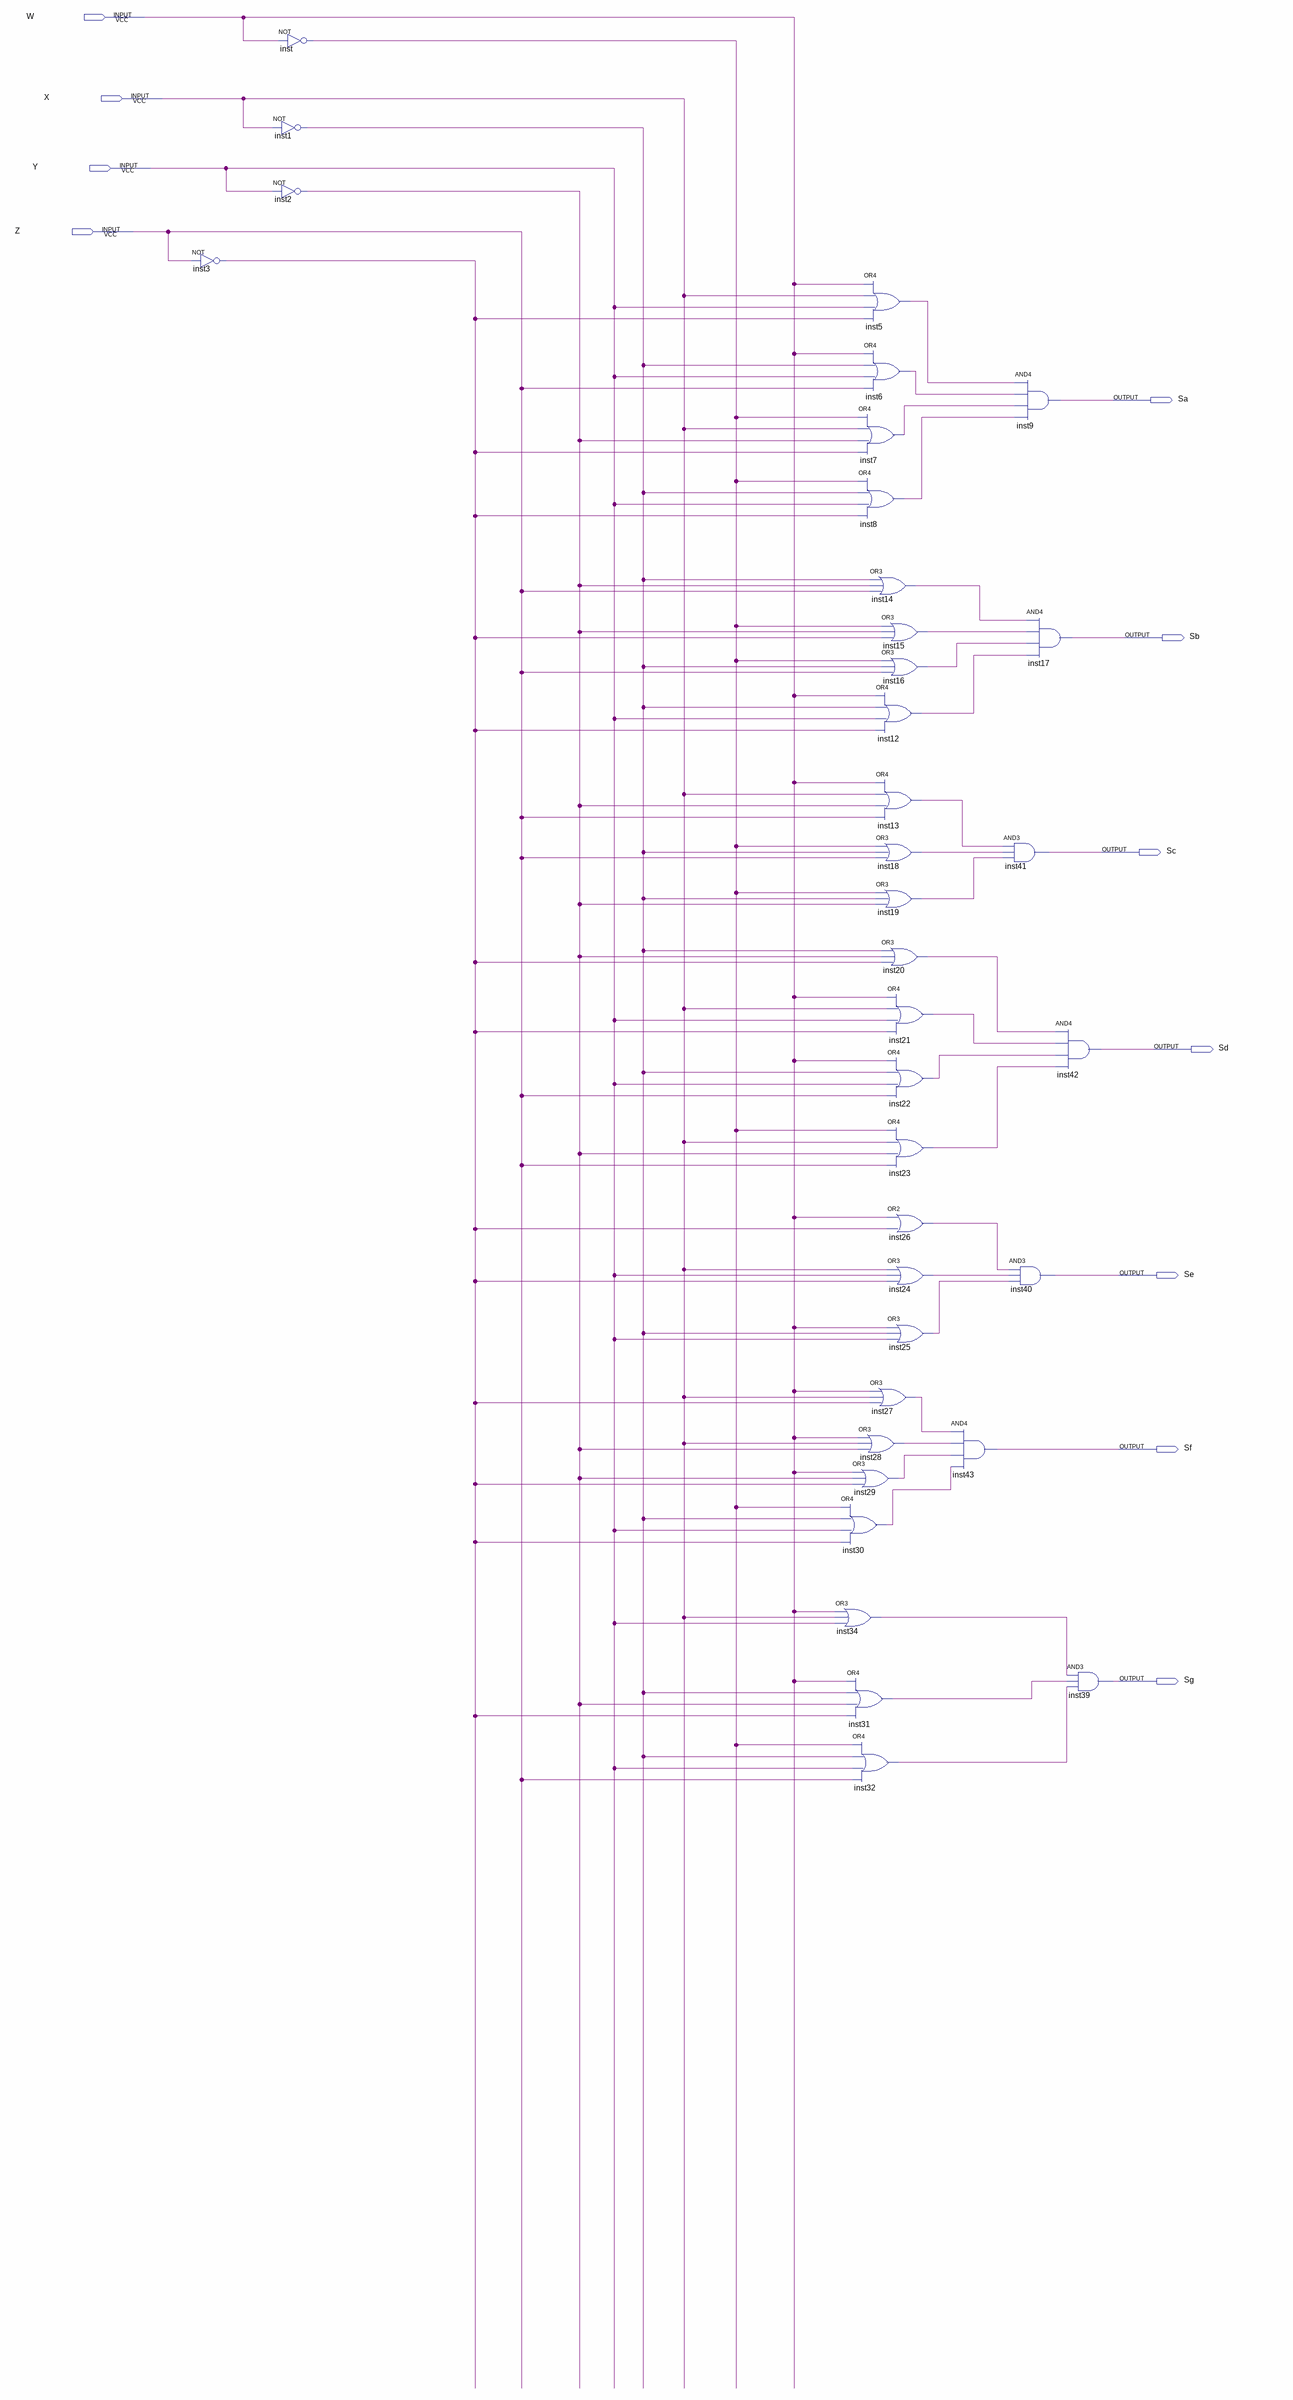
[diagram p0: schematic sheet]
// Quartus schematic lab1~.bdf as structural Verilog: 36 symbols, 11 pins
module \lab1~  (
  input  W,
  input  X,
  input  Y,
  input  Z,
  output Sa,
  output Sb,
  output Sc,
  output Sd,
  output Se,
  output Sf,
  output Sg
);

  wire inst1_out, inst2_out, inst3_out, inst5_out, inst6_out, inst7_out, inst8_out, inst12_out, inst13_out,
       inst14_out, inst15_out, inst16_out, inst18_out, inst19_out, inst20_out, inst21_out, inst22_out,
       inst23_out, inst24_out, inst25_out, inst26_out, inst27_out, inst28_out, inst29_out, inst30_out,
       inst31_out, inst32_out, inst34_out, inst_out;

  not inst3 (inst3_out, Z);
  not inst1 (inst1_out, X);
  not inst2 (inst2_out, Y);
  not inst (inst_out, W);
  or inst5 (inst5_out, W, X, Y, inst3_out);
  or inst6 (inst6_out, W, inst1_out, Y, Z);
  or inst7 (inst7_out, inst_out, X, inst2_out, inst3_out);
  or inst8 (inst8_out, inst_out, inst1_out, Y, inst3_out);
  or inst14 (inst14_out, inst1_out, inst2_out, Z);
  or inst12 (inst12_out, W, inst1_out, Y, inst3_out);
  or inst13 (inst13_out, W, X, inst2_out, Z);
  or inst18 (inst18_out, inst_out, inst1_out, Z);
  or inst19 (inst19_out, inst_out, inst1_out, inst2_out);
  or inst27 (inst27_out, W, X, inst3_out);
  or inst28 (inst28_out, W, X, inst2_out);
  or inst29 (inst29_out, W, inst2_out, inst3_out);
  or inst30 (inst30_out, inst_out, inst1_out, Y, inst3_out);
  or inst34 (inst34_out, W, X, Y);
  or inst31 (inst31_out, W, inst1_out, inst2_out, inst3_out);
  or inst32 (inst32_out, inst_out, inst1_out, Y, Z);
  or inst15 (inst15_out, inst_out, inst2_out, inst3_out);
  or inst16 (inst16_out, inst_out, inst1_out, Z);
  or inst20 (inst20_out, inst1_out, inst2_out, inst3_out);
  or inst21 (inst21_out, W, X, Y, inst3_out);
  or inst22 (inst22_out, W, inst1_out, Y, Z);
  or inst23 (inst23_out, inst_out, X, inst2_out, Z);
  or inst26 (inst26_out, W, inst3_out);
  or inst24 (inst24_out, X, Y, inst3_out);
  or inst25 (inst25_out, W, inst1_out, Y);
  and inst43 (Sf, inst27_out, inst28_out, inst29_out, inst30_out);
  and inst9 (Sa, inst5_out, inst6_out, inst7_out, inst8_out);
  and inst41 (Sc, inst13_out, inst18_out, inst19_out);
  and inst40 (Se, inst26_out, inst24_out, inst25_out);
  and inst17 (Sb, inst14_out, inst15_out, inst16_out, inst12_out);
  and inst42 (Sd, inst20_out, inst21_out, inst22_out, inst23_out);
  and inst39 (Sg, inst34_out, inst31_out, inst32_out);
endmodule
